# Altium schematic sheet HIVE_BOARD_POWER.SchDoc
size Tabloid; SheetNumber: 4; SheetTotal: 12; Sheet_Name: POWER; Size: 11x17
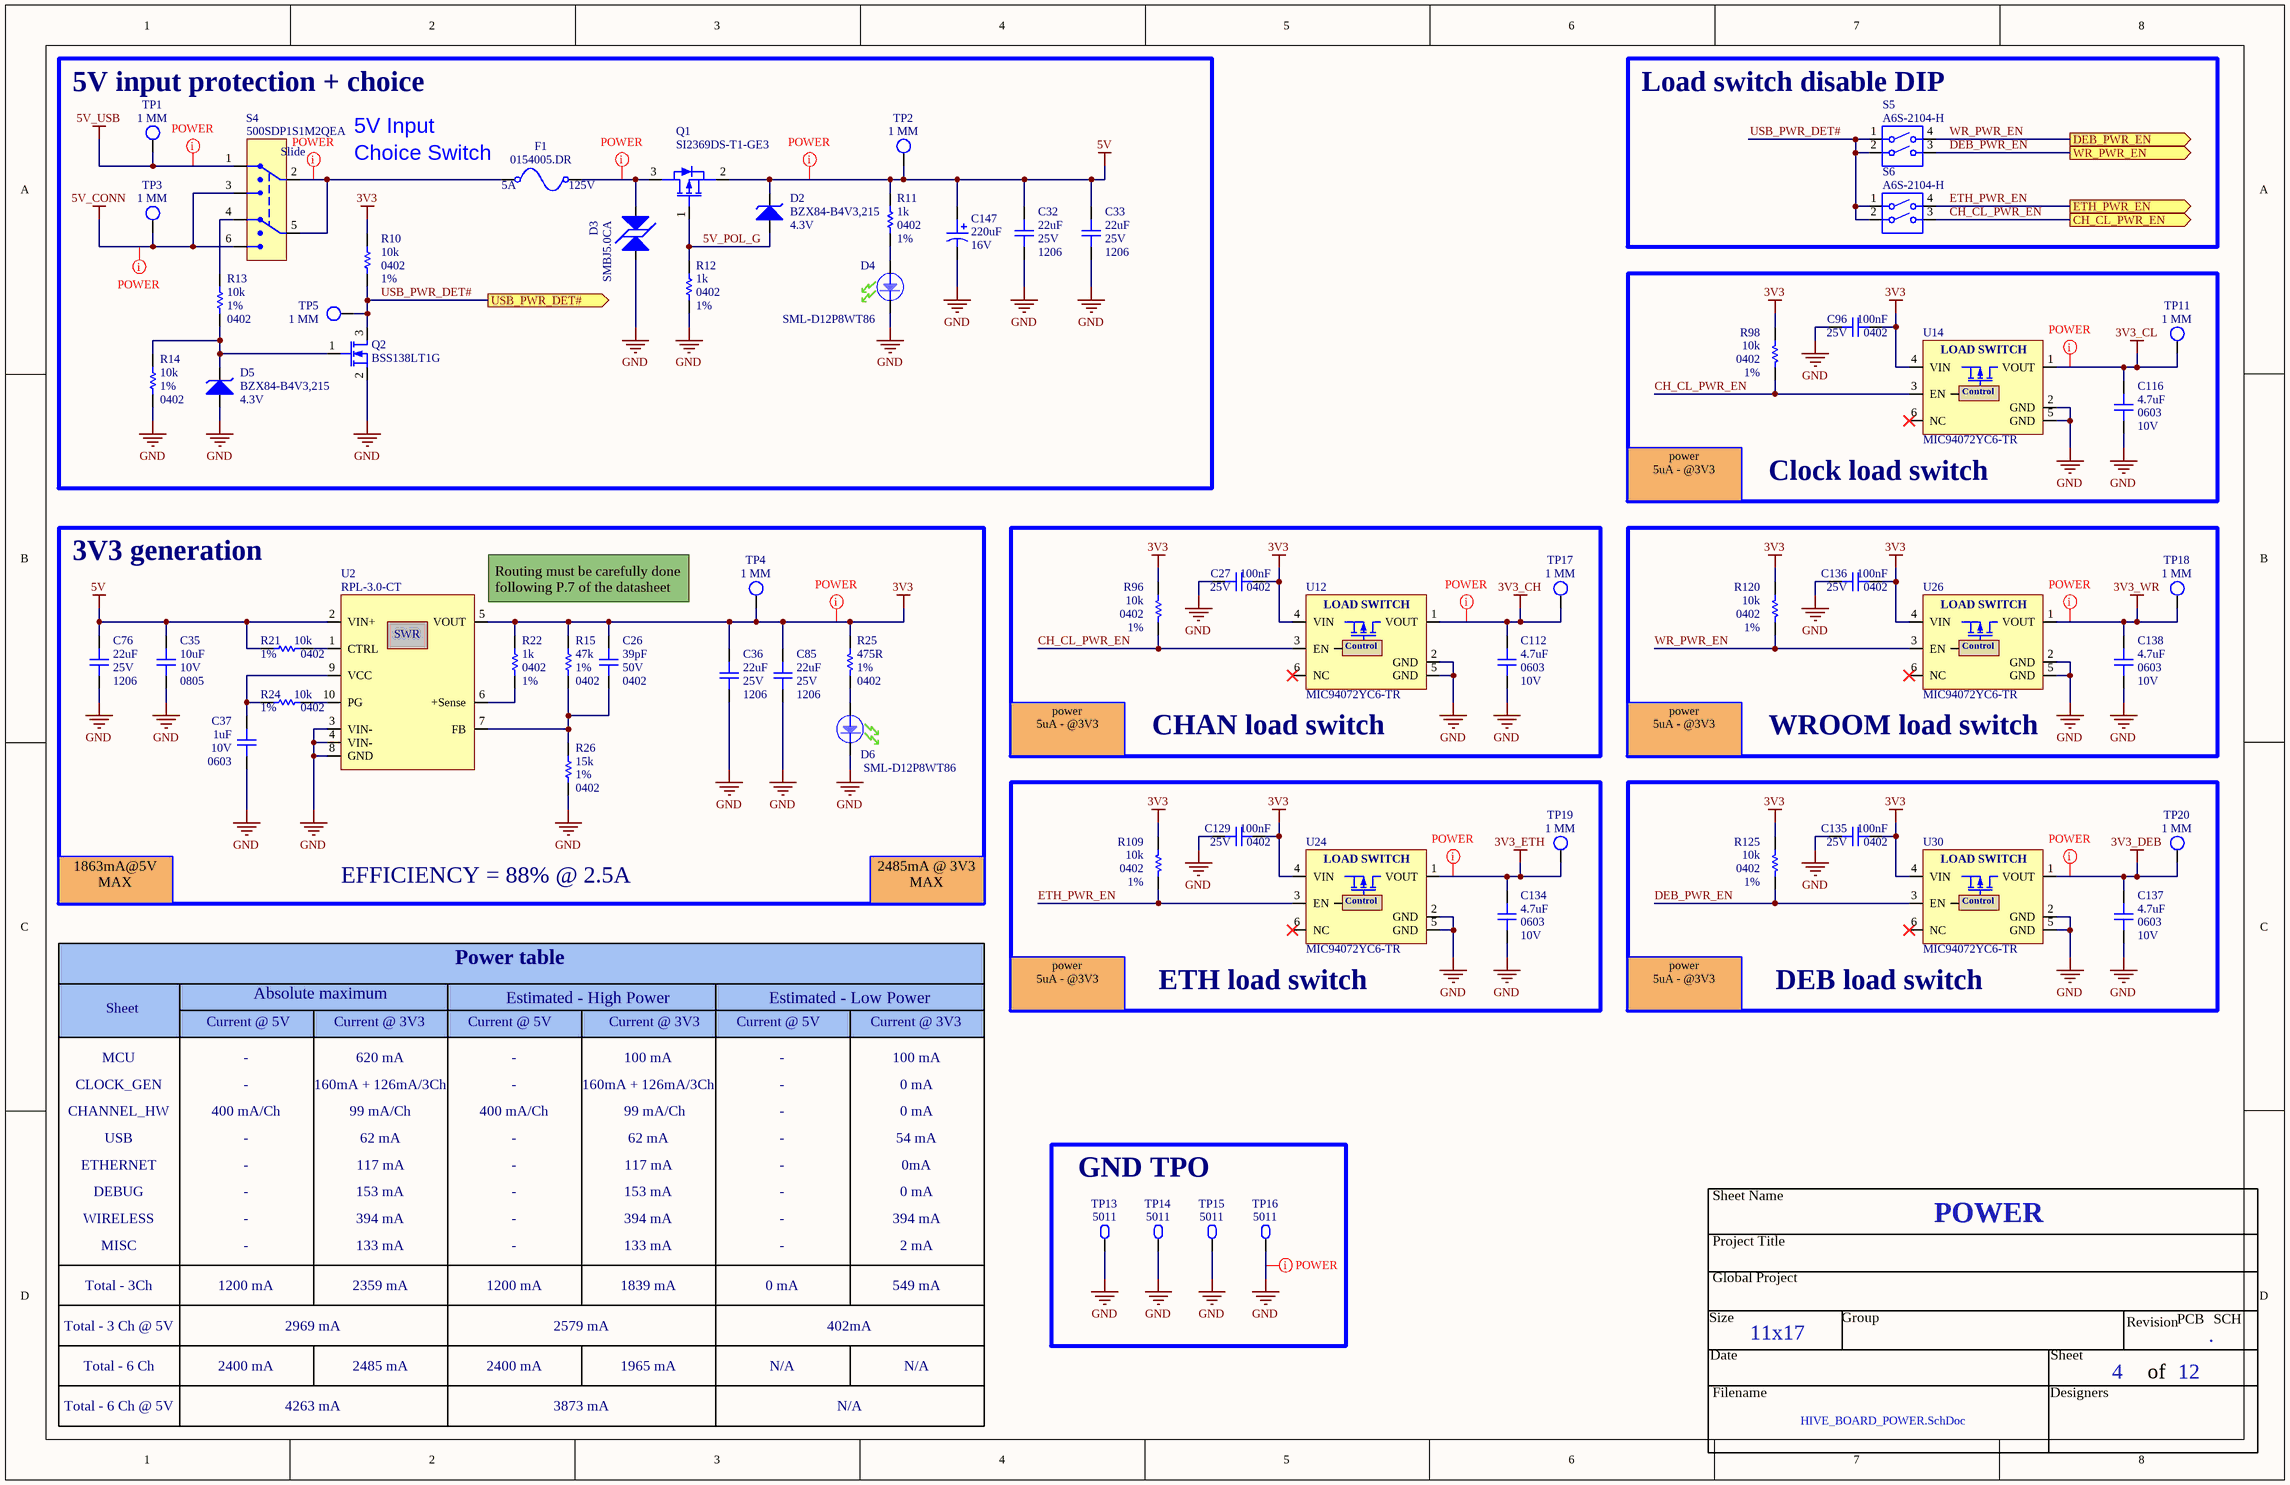
[diagram p0: HIVE_BOARD_POWER.SchDoc]

## Parts
C26  value 39pF  Package: 0402  Voltage Rating: 50V  [CAP_CER_0402]  (hidden comment: CL05C390JB51PNC)
C27  value 100nF  Package: 0402  Voltage Rating: 25V  [CAP_CER_0402]  (hidden comment: CGA2B3X7R1E104K050BB)
C32  value 22uF  Package: 1206  Voltage Rating: 25V  [CAP_CER_1206]  (hidden comment: CL31A226KAHNNNE)
C33  value 22uF  Package: 1206  Voltage Rating: 25V  [CAP_CER_1206]  (hidden comment: CL31A226KAHNNNE)
C35  value 10uF  Package: 0805  Voltage Rating: 10V  [CAP_CER_0805]  (hidden comment: LMK212BJ106KG-T)
C36  value 22uF  Package: 1206  Voltage Rating: 25V  [CAP_CER_1206]  (hidden comment: CL31A226KAHNNNE)
C37  value 1uF  Package: 0603  Voltage Rating: 10V  [CAP_CER_0603]  (hidden comment: C0603C105K8PACTU)
C76  value 22uF  Package: 1206  Voltage Rating: 25V  [CAP_CER_1206]  (hidden comment: CL31A226KAHNNNE)
C85  value 22uF  Package: 1206  Voltage Rating: 25V  [CAP_CER_1206]  (hidden comment: CL31A226KAHNNNE)
C96  value 100nF  Package: 0402  Voltage Rating: 25V  [CAP_CER_0402]  (hidden comment: CGA2B3X7R1E104K050BB)
C112  value 4.7uF  Package: 0603  Voltage Rating: 10V  [CAP_CER_0603]  (hidden comment: CL10A475KP8NNNC)
C116  value 4.7uF  Package: 0603  Voltage Rating: 10V  [CAP_CER_0603]  (hidden comment: CL10A475KP8NNNC)
C129  value 100nF  Package: 0402  Voltage Rating: 25V  [CAP_CER_0402]  (hidden comment: CGA2B3X7R1E104K050BB)
C134  value 4.7uF  Package: 0603  Voltage Rating: 10V  [CAP_CER_0603]  (hidden comment: CL10A475KP8NNNC)
C135  value 100nF  Package: 0402  Voltage Rating: 25V  [CAP_CER_0402]  (hidden comment: CGA2B3X7R1E104K050BB)
C136  value 100nF  Package: 0402  Voltage Rating: 25V  [CAP_CER_0402]  (hidden comment: CGA2B3X7R1E104K050BB)
C137  value 4.7uF  Package: 0603  Voltage Rating: 10V  [CAP_CER_0603]  (hidden comment: CL10A475KP8NNNC)
C138  value 4.7uF  Package: 0603  Voltage Rating: 10V  [CAP_CER_0603]  (hidden comment: CL10A475KP8NNNC)
C147  value 220uF  Voltage Rating: 16V  [CAP_POLY_APXG160ARA221MF80G]  (hidden comment: APXG160ARA221MF80G)
D2  BZX84-B4V3,215  value 4.3V  [DIO_ZENER_BZX84-B4V3,215]
D3  SMBJ5.0CA  [TVS_PWR_SMBJ5.0CA]
D4  SML-D12P8WT86  [LED_SML-D12P8WT86]
D5  BZX84-B4V3,215  value 4.3V  [DIO_ZENER_BZX84-B4V3,215]
D6  SML-D12P8WT86  [LED_SML-D12P8WT86]
F1  0154005.DR  Voltage Rating: 125V  Current Rating: 5A  [FUS_0154XXX.DR]
Q1  SI2369DS-T1-GE3  [TRX_PMOS_SI2369DS-T1-GE3]
Q2  BSS138LT1G  [TRX_NMOS_BSS138LT1G]
R10  value 10k  Tolerance: 1%  Package: 0402  [RES_0402]  (hidden comment: RC0402FR-0710KL)
R11  value 1k  Tolerance: 1%  Package: 0402  [RES_0402]  (hidden comment: RC0402FR-071KL)
R12  value 1k  Tolerance: 1%  Package: 0402  [RES_0402]  (hidden comment: RC0402FR-071KL)
R13  value 10k  Tolerance: 1%  Package: 0402  [RES_0402]  (hidden comment: RC0402FR-0710KL)
R14  value 10k  Tolerance: 1%  Package: 0402  [RES_0402]  (hidden comment: RC0402FR-0710KL)
R15  value 47k  Tolerance: 1%  Package: 0402  [RES_0402]  (hidden comment: RC0402FR-0747KL)
R21  value 10k  Tolerance: 1%  Package: 0402  [RES_0402]  (hidden comment: RC0402FR-0710KL)
R22  value 1k  Tolerance: 1%  Package: 0402  [RES_0402]  (hidden comment: RC0402FR-071KL)
R24  value 10k  Tolerance: 1%  Package: 0402  [RES_0402]  (hidden comment: RC0402FR-0710KL)
R25  value 475R  Tolerance: 1%  Package: 0402  [RES_0402]  (hidden comment: ERJ-2RKF4750X)
R26  value 15k  Tolerance: 1%  Package: 0402  [RES_0402]  (hidden comment: RC0402FR-0715KL)
R96  value 10k  Tolerance: 1%  Package: 0402  [RES_0402]  (hidden comment: RC0402FR-0710KL)
R98  value 10k  Tolerance: 1%  Package: 0402  [RES_0402]  (hidden comment: RC0402FR-0710KL)
R109  value 10k  Tolerance: 1%  Package: 0402  [RES_0402]  (hidden comment: RC0402FR-0710KL)
R120  value 10k  Tolerance: 1%  Package: 0402  [RES_0402]  (hidden comment: RC0402FR-0710KL)
R125  value 10k  Tolerance: 1%  Package: 0402  [RES_0402]  (hidden comment: RC0402FR-0710KL)
S4  500SDP1S1M2QEA  [SWI_500SDP1S1M2QEA]
S5  A6S-2104-H  [SWI_A6S-2104-H]
S6  A6S-2104-H  [SWI_A6S-2104-H]
TP1  1 MM  [TPO_SMD_ROUND_1MM]  (no BOM)
TP2  1 MM  [TPO_SMD_ROUND_1MM]  (no BOM)
TP3  1 MM  [TPO_SMD_ROUND_1MM]  (no BOM)
TP4  1 MM  [TPO_SMD_ROUND_1MM]  (no BOM)
TP5  1 MM  [TPO_SMD_ROUND_1MM]  (no BOM)
TP11  1 MM  [TPO_SMD_ROUND_1MM]  (no BOM)
TP13  5011  [TPO_5011]
TP14  5011  [TPO_5011]
TP15  5011  [TPO_5011]
TP16  5011  [TPO_5011]
TP17  1 MM  [TPO_SMD_ROUND_1MM]  (no BOM)
TP18  1 MM  [TPO_SMD_ROUND_1MM]  (no BOM)
TP19  1 MM  [TPO_SMD_ROUND_1MM]  (no BOM)
TP20  1 MM  [TPO_SMD_ROUND_1MM]  (no BOM)
U2  RPL-3.0-CT  [REG_SWR_RPL-3.0-CT]
U12  MIC94072YC6-TR  [POW_MIC94072YC6-TR]
U14  MIC94072YC6-TR  [POW_MIC94072YC6-TR]
U24  MIC94072YC6-TR  [POW_MIC94072YC6-TR]
U26  MIC94072YC6-TR  [POW_MIC94072YC6-TR]
U30  MIC94072YC6-TR  [POW_MIC94072YC6-TR]

## Blocks framed on the sheet
5V input protection + choice: C32 C33 C147 D2-D5 F1 Q1 Q2 R10-R14 S4 TP1-TP3 TP5
Load switch disable DIP: S5 S6
Clock load switch: C96 C116 R98 TP11 U14
3V3 generation: C26 C35-C37 C76 C85 D6 R15 R21 R22 R24-R26 TP4 U2
CHAN load switch: C27 C112 R96 TP17 U12
WROOM load switch: C136 C138 R120 TP18 U26
ETH load switch: C129 C134 R109 TP19 U24
DEB load switch: C135 C137 R125 TP20 U30
GND TPO: TP13-TP16

## Ports
CH_CL_PWR_EN (out), DEB_PWR_EN (out), ETH_PWR_EN (out), USB_PWR_DET# (out), WR_PWR_EN (out)

## Nets
3V3: C26.2 C27.1 C36.2 C85.2 C96.1 C129.1 C135.1 C136.1 R10.1 R15.2 R22.1 R25.2 R96.1 R98.1 R109.1 R120.1 R125.1 TP4.1 U2.5(VOUT) U12.4(VIN) U14.4(VIN) U24.4(VIN) U26.4(VIN) U30.4(VIN)
3V3_CH: C112.1 TP17.1 U12.1(VOUT)
3V3_CL: C116.1 TP11.1 U14.1(VOUT)
3V3_DEB: C137.1 TP20.1 U30.1(VOUT)
3V3_ETH: C134.1 TP19.1 U24.1(VOUT)
3V3_WR: C138.1 TP18.1 U26.1(VOUT)
5V: C32.2 C33.2 C35.2 C76.2 C147.1 D2.3(K) Q1.2(S) R11.1 R21.2 TP2.1 U2.2(VIN+)
5V_CONN: S4.3 S4.6 TP3.1
5V_USB: S4.1 TP1.1
GND: C27.2 C32.1 C33.1 C35.1 C36.1 C37.2 C76.1 C85.1 C96.2 C112.2 C116.2 C129.2 C134.2 C135.2 C136.2 C137.2 C138.2 C147.2 D3.2 D4.K D5.1(A) D6.K Q2.2(S) R12.2 R14.1 R26.1 TP13.1 TP14.1 TP15.1 TP16.1 U2.3(VIN-) U2.4(VIN-) U2.8(GND) U12.2(GND) U12.5(GND) U14.2(GND) U14.5(GND) U24.2(GND) U24.5(GND) U26.2(GND) U26.5(GND) U30.2(GND) U30.5(GND)
5V_POL_G: D2.1(A) Q1.1(G) R12.1
CH_CL_PWR_EN: R96.2 R98.2 S6.3(LOAD) U12.3(EN) U14.3(EN) ; port CH_CL_PWR_EN
DEB_PWR_EN: R125.2 S5.3(LOAD) U30.3(EN) ; port WR_PWR_EN
ETH_PWR_EN: R109.2 S6.4(LOAD) U24.3(EN) ; port ETH_PWR_EN
USB_PWR_DET#: Q2.3(D) R10.2 S5.1(+CTRL) S5.2(-CTRL) S6.1(+CTRL) S6.2(-CTRL) TP5.1 ; port USB_PWR_DET#
WR_PWR_EN: R120.2 S5.4(LOAD) U26.3(EN) ; port DEB_PWR_EN
NetC26_1: C26.1 R15.1 R26.2 U2.7(FB)
NetC37_1: C37.1 R24.2 U2.9(VCC)
NetD3_1: D3.1 F1.2 Q1.3(D)
NetD4_A: D4.A R11.2
NetD5_3: D5.3(K) Q2.1(G) R13.1 R14.2
NetD6_A: D6.A R25.1
NetF1_1: F1.1 S4.2 S4.5
NetR13_2: R13.2 S4.4
NetR21_1: R21.1 U2.1(CTRL)
NetR22_2: R22.2 U2.6(+Sense)
NetR24_1: R24.1 U2.10(PG)

Not connected (* = marked no-connect by the designer): D2 2(NC); D5 2(NC); U12 6(NC)*; U14 6(NC)*; U24 6(NC)*; U26 6(NC)*; U30 6(NC)*

## Layout directives
net class POWER: 3V3, 3V3_CH, 3V3_CL, 3V3_DEB, 3V3_ETH, 3V3_WR, 5V, 5V_CONN, 5V_USB, GND, NetD3_1, NetF1_1

## Notes on the sheet
- 5V Input
- (near F1) Choice Switch
- power
  5uA - @3V3
- (near U2) Routing must be carefully done following P.7 of the datasheet
- 1863mA@5V MAX
- EFFICIENCY = 88% @ 2.5A
- 2485mA @ 3V3 MAX
- Power table
- Sheet
- Current @ 5V
- Absolute maximum
- Current @ 3V3
- Estimated - High Power
- Estimated - Low Power
- MCU
- CLOCK_GEN
- CHANNEL_HW
- -
- 400 mA/Ch
- 160mA + 126mA/3Ch
- 99 mA/Ch
- 620 mA
- 100 mA
- 0 mA
- USB
- ETHERNET
- 62 mA
- 117 mA
- 54 mA
- 0mA
- DEBUG
- WIRELESS
- MISC
- 153 mA
- 394 mA
- 133 mA
- 2 mA
- Total - 3Ch
- 1200 mA
- 2359 mA
- 1839 mA
- 549 mA
- Total - 3 Ch @ 5V
- Total - 6 Ch
- 2400 mA
- 2969 mA
- 2485 mA
- 2579 mA
- 1965 mA
- N/A
- 402mA
- Total - 6 Ch @ 5V
- 4263 mA
- 3873 mA
- Sheet Name
- Project Title
- Global Project
- Size
- Date
- Group
- Revision
- of
- PCB
- .
- SCH
- Filename
- Designers
- (in symbol POW_MIC94072YC6-TR) LOAD SWITCH; Control
- (in symbol REG_SWR_RPL-3.0-CT) SWR
- (in symbol SWI_500SDP1S1M2QEA) Slide

## Library data of the parts
C26 = CAP_CER_CL05C390JB51PNC: CAP - CER 39 pF 5% 50V COG/NP0 - 0402; Manufacturer #1: Samsung Electro-Mechanics; GRAMS Lib Spec: 2.8; Magnetic Material: Unknown; Polarized: NO; Assembly Type: SMD; CreatedBy/Date: Louis-Daniel Gaulin / 11-04-2021; Current Rating: *; HelpURL: https://www.samsungsem.com/resources/file/global/support/product_catalog/MLCC.pdf; Manufacturer #2: *; Part Number #1: CL05C390JB51PNC; Part Number #2: *; Power Max: *; Temperature: -55°C ~ 125°C; Tolerance: 5%; VerifiedBy: Philippe Arsenault/2021-04-14; Supplier 1: Digi-Key; Supplier Part Number 1: 1276-6863-1-ND; Cryo: UNKNOWN
C27 C96 C129 C135 C136 = CAP_CER_CGA2B3X7R1E104K050BB: CAP - CER 0.1µF 10% 25V X7R - 0402; Manufacturer #1: TDK Corporation; GRAMS Lib Spec: 2.8; Magnetic Material: Unknown; Polarized: NO; Assembly Type: SMD; CreatedBy/Date: Nicolas Roy 2018-11-07; Current Rating: *; HelpURL: https://product.tdk.com/info/en/catalog/datasheets/mlcc_automotive_general_en.pdf; Manufacturer #2: *; Note: *; Part Number #1: CGA2B3X7R1E104K050BB; Part Number #2: *; Power Max: *; Temperature: -55°C ~ 125°C; Tolerance: 10%; VerifiedBy: Nicolas V. (2019-01-22); Supplier 1: Digi-Key; Supplier Part Number 1: 445-6902-1-ND; Cryo: UNKNOWN
C32 C33 C36 C76 C85 = CAP_CER_CL31A226KAHNNNE: CAP - CER 22uF 10% 25V X5R - 1206; Manufacturer #1: Samsung Electro-Mechanics; GRAMS Lib Spec: 2.8; Magnetic Material: Unknown; Polarized: NO; Assembly Type: SMD; CreatedBy/Date: Philippe Arsenault/21 Janvier 2020; Current Rating: *; HelpURL: http://www.samsungsem.com/global/support/product-search/mlcc/1207445_4880.html; Manufacturer #2: *; Note: *; Part Number #1: CL31A226KAHNNNE; Part Number #2: 1276-3047-1-ND; Power Max: *; Temperature: -55°C ~ 85°C; Tolerance: 10%; VerifiedBy: C.Paulin - 28/01/2020; Supplier 1: Digi-Key; Supplier Part Number 1: 1276-3047-1-ND; Cryo: UNKNOWN
C35 = CAP_CER_LMK212BJ106KG-T: CAP - CER 10UF 10% 10V X5R - 0805; Manufacturer #1: Taiyo Yuden; GRAMS Lib Spec: 2.8; Magnetic Material: Unknown; Polarized: NO; Assembly Type: SMD; CreatedBy/Date: Caroline Paulin / 25 juillet 2018; Current Rating: *; HelpURL: https://www.yuden.co.jp/productdata/catalog/mlcc_all_e.pdf; Manufacturer #2: *; Note: *; Part Number #1: LMK212BJ106KG-T; Part Number #2: *; Power Max: *; Temperature: -55°C ~ 85°C; Tolerance: 10%; VerifiedBy: Nicolas V. (2019-01-22); Supplier 1: Digi-Key; Supplier Part Number 1: 587-1300-1-ND; Cryo: UNKNOWN
C37 = CAP_CER_C0603C105K8PACTU: CAP - CER 1uF 10V 10% X5R - 0603; Manufacturer #1: KEMET; GRAMS Lib Spec: 2.8; Magnetic Material: Unknown; Polarized: NO; Tolerance: 10%; Current Rating: *; Power Max: *; HelpURL: https://content.kemet.com/datasheets/KEM_C1006_X5R_SMD.pdf; CreatedBy/Date: Hubert Dube - 21/07/20; VerifiedBy: Louis-Daniel Gaulin - 21/07/20; Temperature: -55°C ~ 85°C; Manufacturer #2: *; Assembly Type: SMD; Part Number #2: *; Part Number #1: C0603C105K8PACTU; Cryo: UNKNOWN; Supplier 1: Digi-Key; Supplier Part Number 1: 399-3118-1-ND
C112 C116 C134 C137 C138 = CAP_CER_CL10A475KP8NNNC: 4.7µF ±10% 10V Ceramic Capacitor X5R 0603; Manufacturer #1: Samsung Electro-Mechanics; GRAMS Lib Spec: 2.8; Magnetic Material: Unknown; Polarized: No; Tolerance: 10%; Current Rating: *; Power Max: *; HelpURL: https://www.samsungsem.com/resources/file/global/support/product_catalog/MLCC.pdf; CreatedBy/Date: Hubert Dube - 25/02/2021; VerifiedBy: Philippe Arsenault/2021-03-14; Temperature: -55°C ~ 85°C; Manufacturer #2: *; Note: *; Assembly Type: SMD; Part Number #2: *; Part Number #1: CL10A475KP8NNNC; Cryo: UNKNOWN; Supplier 1: Digi-Key; Supplier Part Number 1: 1276-1044-1-ND
C147 = CAP_POLY_APXG160ARA221MF80G: CAP - POLY 220uF 20% 16V - SMD 6.3mm D x 8mm H; Manufacturer #1: United Chemi-Con; Current Rating: 3.3A; GRAMS Lib Spec: 2.8; Magnetic Material: Unknown; Polarized: Yes; Assembly Type: SMD; CreatedBy/Date: Joel Lemay 2018-08-21; HelpURL: http://www.chemi-con.co.jp/cgi-bin/CAT_DB/SEARCH/cat_db_al.cgi?e=e&j=p&pdfname=pxg; Manufacturer #2: *; Note: *; Part Number #1: APXG160ARA221MF80G; Part Number #2: *; Power Max: *; Temperature: -55°C ~ 105°C; Tolerance: 20%; VerifiedBy: Caroline Paulin - 7 sept 2018; Supplier 1: Digi-Key; Supplier Part Number 1: 565-4283-1-ND; Package: Radial, Can - SMD; Cryo: UNKNOWN
D2 D5 = DIO_ZENER_BZX84-B4V3,215: DIO - ZENER 4.3V 250mW - SOT-23; Manufacturer #1: Nexperia USA Inc.; Current Rating: 200mA foward; GRAMS Lib Spec: 2.8c; Magnetic Material: Unknown; Polarized: Yes; Tolerance: 2%; Assembly Type: SMD; CreatedBy/Date: Louis-Daniel Gaulin / 29-03-2021; HelpURL: https://assets.nexperia.com/documents/data-sheet/BZX84_SER.pdf; Manufacturer #2: -; Note: -; Package: SOT-23; Part Number #1: BZX84-B4V3,215; Part Number #2: -; Power Max: 250mW; Temperature: -65°C ~ 150°C; VerifiedBy: Philippe Arsenault/ 2021-04-01; Voltage Rating: 4.3V; Cryo: UNKNOWN; Supplier 1: Digi-Key; Supplier Part Number 1: 1727-1669-1-ND
D3 = TVS_PWR_SMBJ5.0CA: TVS - BIDIR 5V 9.2V 600W - DO214AA; Manufacturer #1: Littelfuse Inc.; Value: Vbr = 6.4V -  Clamp = 9.2V; Voltage Rating: 5V Standoff; Current Rating: 65.3 A (Ipp); Power Max: 600W (Pppm); GRAMS Lib Spec: 2.8; Magnetic Material: UNKNOWN; Polarized: NO; Tolerance: *; HelpURL: http://www.littelfuse.com/~/media/electronics/datasheets/tvs_diodes/littelfuse_tvs_diode_smbj_datasheet.pdf.pdf; CreatedBy/Date: Jonathan Bouchard - 2019-03-22; VerifiedBy: Nicolas V. (2019-05-06); Temperature: -65°C ~ 150°C (TJ); Package: DO214AA; Manufacturer #2: *; Note: *; Assembly Type: SMD; Part Number #2: *; Part Number #1: SMBJ5.0CA; Supplier 1: Digi-Key; Supplier Part Number 1: SMBJ5.0CALFCT-ND; Cryo: UNKNOWN
D4 D6 = LED_SML-D12P8WT86: LED - GREEN DIFFUSED 0603 SMD - 0603; Manufacturer #1: Rohm Semiconductor; Current Rating: 1-20mA; Note: Operate at 2mA; Value: 560 nm (green); Voltage rating: 2.2V (Forward), 5V (max Reverse); Polarized: Yes; Magnetic Material: Unknown; GRAMS Lib Spec: 2.8; Manufacturer #2: *; Power Max: *; Part Number #1: SML-D12P8WT86; Part Number #2: *; HelpURL: https://d1d2qsbl8m0m72.cloudfront.net/en/products/databook/datasheet/opto/led/chip_mono/sml-d12x8_d13x8-e.pdf; Supplier 1: Digi-Key; Supplier Part Number 1: 511-1579-2-ND; Assembly Type: SMD; Temperature: -40 ~ 85 °C; Package: 0603; CreatedBy/Date: Keven Deslandes - 2018/11/21; Tolerance: *; VerifiedBy: Caroline Paulin - 13 février 2019; Cryo: UNKNOWN
F1 = FUS_0154005.DR: FUS - 5 A 125 VAC/VDC - 2-SMD; Manufacturer #1: Littelfuse Inc.; Value: 5A 125V AC/DC FAST; GRAMS Lib Spec: 2.8; Magnetic Material: UNKNOWN; Polarized: NO; Tolerance: *; Power Max: *; HelpURL: http://www.littelfuse.com/~/media/electronics/datasheets/fuses/littelfuse_fuse_154_154t_154l_154tl_datasheet.pdf.pdf; CreatedBy/Date: Arnaud Samson - 06/07/18; VerifiedBy: Jonathan Bouchard 2018-07-16; Temperature: -55°C ~ 125°C; Package: 2-SMD; Manufacturer #2: *; Note: *; Assembly Type: SMD; Part Number #2: *; Part Number #1: 0154005.DR; Supplier 1: Digi-Key; Supplier Part Number 1: F1228CT-ND; Cryo: UNKNOWN
Q1 = TRX_PMOS_SI2369DS-T1-GE3: TRX - PMOS 30V 7.6A - SOT−23; Manufacturer #1: Vishay Siliconix; GRAMS Lib Spec: 2.8; Magnetic Material: Unknown; Polarized: Yes; Power Max: 1.25W; Assembly Type: SMD; CreatedBy/Date: Louis-Daniel Gaulin / 30-07-2020; Current Rating: 7.6A; HelpURL: https://www.vishay.com/docs/62865/si2369d.pdf; Manufacturer #2: *; Package: SOT-23; Part Number #1: SI2369DS-T1-GE3; Part Number #2: *; Supplier 1: Digi-Key; Supplier Part Number 1: SI2369DS-T1-GE3CT-ND; Temperature: -55°C ~ 150°C; Tolerance: *; Value: *; VerifiedBy: Philippe Arsenault/2020-11-06; Voltage Rating: 30V; Cryo: UNKNOWN
Q2 = TRX_NMOS_BSS138LT1G: TRX - NMOS - 50V 200MA - SOT−23-3; Manufacturer #1: ON Semiconductor; GRAMS Lib Spec: 2.8; Magnetic Material: Unknown; Polarized: Yes; Power Max: 225mW; Assembly Type: SMD; CreatedBy/Date: Joel Lemay 2018-06-15; Current Rating: 200mA; HelpURL: http://www.onsemi.com/pub/Collateral/BSS138LT1-D.PDF; Manufacturer #2: *; Package: SOT-23-3; Part Number #1: BSS138LT1G; Part Number #2: *; Supplier 1: Digi-Key; Supplier Part Number 1: BSS138LT1GOSCT-ND; Temperature: -55°C ~ 150°C; Tolerance: *; Value: *; VerifiedBy: Caroline Paulin - 6 sept 2018; Voltage Rating: 50V; Cryo: UNKNOWN
R10 R13 R14 R21 R24 R96 R98 R109 R120 R125 = RES_RC0402FR-0710KL: RES - 10K OHMS 1% 1/16W - 0402; Manufacturer #1: Yageo; GRAMS Lib Spec: 2.8; Magnetic Material: UNKNOWN; Polarized: NO; Voltage Rating: 50V; Assembly Type: SMD; CreatedBy/Date: Nicolas V. (2018-11-20); Current Rating: *; HelpURL: http://www.yageo.com/documents/recent/PYu-RC_Group_51_RoHS_L_9.pdf; Manufacturer #2: *; Note: *; Part Number #1: RC0402FR-0710KL; Part Number #2: *; Power Max: 1/16W; Temperature: -55°C ~ 155°C; VerifiedBy: Nicolas V. (2018-11-20); Supplier 1: Digi-Key; Supplier Part Number 1: 311-10.0KLRCT-ND; Cryo: UNKNOWN
  R10 R21 R24 R96 R98 R109 R120 R125: Solder Paste Type: UNKNOWN; Stencil Thickness (Recommended): UNKNOWN
R11 R12 R22 = RES_RC0402FR-071KL: RES - 1K OHM 1% 1/16W - 0402; Manufacturer #1: Yageo; GRAMS Lib Spec: 2.8; Magnetic Material: YES; Polarized: NO; Voltage Rating: 50V; Cryo: UNKNOWN; Assembly Type: SMD; CreatedBy/Date: Jonathan Bouchard 2018-07-05; Current Rating: *; HelpURL: http://www.yageo.com/documents/recent/PYu-RC_Group_51_RoHS_L_9.pdf; Manufacturer #2: *; Note: *; Part Number #1: RC0402FR-071KL; Part Number #2: *; Power Max: 1/16W; Temperature: -55°C ~ 155°C; VerifiedBy: Arnaud Samson 16-07-18; Supplier 1: Digi-Key; Supplier Part Number 1: 311-1.00KLRCT-ND
R15 = RES_RC0402FR-0747KL: RES - 47k ±1% 1/16W - 0402; Manufacturer #1: Yageo; GRAMS Lib Spec: 2.8; Magnetic Material: Unknown; Polarized: No; Voltage Rating: 50V; Assembly Type: SMD; CreatedBy/Date: Louis-Daniel Gaulin / 11-04-2021; Current Rating: *; HelpURL: https://www.yageo.com/upload/media/product/productsearch/datasheet/rchip/PYu-RC_Group_51_RoHS_L_11.pdf; Manufacturer #2: *; Note: *; Part Number #1: RC0402FR-0747KL; Part Number #2: *; Power Max: 1/16W; Temperature: -55°C ~ 155°C; VerifiedBy: Philippe Arsenault/2021-04-14; Supplier 1: Digi-Key; Supplier Part Number 1: 311-47.0KLRCT-ND
R25 = RES_ERJ-2RKF4750X: RES - 475R 1% 1/10W- 0402; Manufacturer #1: Panasonic Electronic Components; GRAMS Lib Spec: 2.8; Power Max: 1/10W; Magnetic Material: Unknown; Polarized: No; Voltage Rating: 50V; Assembly Type: SMD; CreatedBy/Date: Keven Deslandes 2018-10-17; Current Rating: *; HelpURL: https://industrial.panasonic.com/cdbs/www-data/pdf/RDA0000/AOA0000C304.pdf; Manufacturer #2: *; Part Number #1: ERJ-2RKF4750X; Part Number #2: *; Temperature: -55°C ~ 155°C; VerifiedBy: Carolilne Paulin - 18/12/2018; Supplier 1: Digi-Key; Supplier Part Number 1: P475LCT-ND; Cryo: UNKNOWN
R26 = RES_RC0402FR-0715KL: RES - 15K 1% 1/16W - 0402; Manufacturer #1: Yageo; GRAMS Lib Spec: 2.8; Magnetic Material: Unknown; Polarized: No; Voltage Rating: 50V; Assembly Type: SMD; CreatedBy/Date: Keven Deslandes 2018-09-24; Current Rating: *; HelpURL: http://www.yageo.com/documents/recent/PYu-RC_Group_51_RoHS_L_9.pdf; Manufacturer #2: *; Part Number #1: RC0402FR-0715KL; Part Number #2: *; Power Max: 1/16W; Temperature: -55°C ~ 155°C; VerifiedBy: Caroline Paulin - 18/12/2018; Supplier 1: Digi-Key; Supplier Part Number 1: 311-15.0KLRCT-ND; Cryo: UNKNOWN
S4 = SWI_500SDP1S1M2QEA: SWI - SLIDE DPDT 5A 120V - TH; Manufacturer #1: E-Switch; Voltage Rating: 120VAC/28VDC; GRAMS Lib Spec: 2.8c; Magnetic Material: Unknown; Polarized: Yes; Value: DPDT; Tolerance: -; Current Rating: 5A; Power Max: -; HelpURL: https://sten-eswitch-13110800-production.s3.amazonaws.com/system/asset/product_line/data_sheet/115/500.pdf; CreatedBy/Date: Louis-Daniel Gaulin / 29-04-2021; VerifiedBy: Philippe Arsenault/ 2021-04-30; Temperature: -30°C ~ 85°C; Package: 12.7x11.43mm plastic; Manufacturer #2: -; Assembly Type: TH; Part Number #2: -; Part Number #1: 500SDP1S1M2QEA; Supplier 1: Digi-Key; Supplier Part Number 1: EG2475-ND; Cryo: UNKNOWN
S5 S6 = SWI_A6S-2104-H: SWI - Dip Switch SPST 2 Pos 25mA 24V - SMD; Manufacturer #1: Omron Electronics Inc-EMC Div; GRAMS Lib Spec: 2.8; Magnetic Material: Unknown; Polarized: Yes; Voltage Rating: 24VDC; Assembly Type: SMD; CreatedBy/Date: Joel Lemay 2018-06-15; Current Rating: 25mA; HelpURL: http://omronfs.omron.com/en_US/ecb/products/pdf/en-a6s.pdf; Manufacturer #2: *; Package: DIP_SMD; Part Number #1: A6S-2104-H; Part Number #2: *; Power Max: *; Supplier 1: Digi-Key; Supplier Part Number 1: SW1009-ND; Temperature: -20°C ~ 70°C; Tolerance: *; Value: *; VerifiedBy: Caroline Paulin - 6 sept 2018; Cryo: UNKNOWN
TP1-TP5 TP11 TP17-TP20 = TPO_SMD_ROUND_1MM: TPO - TEST POINT ROUND SMD PAD ONLY  - 1 MM; Magnetic Material: NO; GRAMS Lib Spec: 2.8; Cryo: UNKNOWN; Current Rating: *; Manufacturer #1: *; Manufacturer #2: *; Note: *; Power Max: *; Value: *; Part Number #1: *; Part Number #2: *; HelpURL: *; Polarized: *; Supplier 1: *; Assembly Type: NONE; Supplier Part Number 1: *; Package: 1 MM ROUND; CreatedBy/Date: Jonathan Bouchard 2018-07-17; Temperature: *; Tolerance: *; VerifiedBy: Arnaud Samson 23-07-18; Voltage Rating: *
TP13-TP16 = TPO_5011: TPO - TEST POINT - TH; Manufacturer #1: Keystone Electronics; Polarized: No; Magnetic Material: UNKNOWN; GRAMS Lib Spec: 2.8; Current Rating: *; Manufacturer #2: *; Note: *; Power Max: *; Value: *; Part Number #1: 5011; Part Number #2: *; HelpURL: https://www.keyelco.com/userAssets/file/M65p56.pdf; Assembly Type: TH; Package: *; CreatedBy/Date: Louis-Daniel Gauli / 02-11-2020; Temperature: *; Tolerance: *; VerifiedBy: Philippe Arsenault/2020-11-06; Voltage Rating: *; Cryo: UNKNOWN; Supplier 1: Digi-Key
U2 = REG_SWR_RPL-3.0-CT: REG_DC DC CONVERTER 3~18V input 0.8~5.2V output 3A - 10-SMD; Manufacturer #1: Recom Power; Voltage Rating: 3~18V (IN), 0.8~5.2V (OUT); GRAMS Lib Spec: 2.8c; Magnetic Material: Unknown; Polarized: Yes; Value: *; Tolerance: *; Current Rating: 3A; Power Max: *; HelpURL: https://recom-power.com/pdf/Innoline/RPL-3.0.pdf; CreatedBy/Date: Louis-Daniel Gaulin / 11-04-2021; VerifiedBy: Philippe Arsenault/2021-04-14; Temperature: -40°C~125°C; Package: 10-SMD; Manufacturer #2: *; Note: *; Assembly Type: SMD; Part Number #2: *; Part Number #1: Recom Power; Cryo: UNKNOWN; Supplier 1: Digi-Key; Supplier Part Number 1: 945-RPL-3.0-CT-ND
U12 U14 U24 U26 U30 = POW_MIC94072YC6-TR: POW - Load switch 1.2A 120mOhm 1:1 P-Channel -  SC-70-6; Manufacturer #1: Microship Technology; Voltage Rating: 1.7V ~ 5.5V; GRAMS Lib Spec: 2.8c; Magnetic Material: Unknown; Polarized: Yes; Value: 120mOhm; Tolerance: *; Current Rating: 1.2A; Power Max: *; HelpURL: https://ww1.microchip.com/downloads/en/DeviceDoc/mic94070-3.pdf; CreatedBy/Date: Louis-Daniel Gaulin / 29-04-2021; VerifiedBy: Philippe Arsenault/2021-04-30; Temperature: -40°C ~ 125°C (TA); Package: SC-70-6; Manufacturer #2: *; Assembly Type: SMD; Part Number #2: *; Part Number #1: MIC94072YC6-TR; Cryo: UNKNOWN; Supplier 1: Digi-Key; Supplier Part Number 1: 576-3580-1-ND